# Altium schematic sheet mcu.SchDoc: mcu
size 420 x 297 mm; Date: 2021-12-08; Author: Joachim Löfwander; Revision: AAA-000; SheetNumber: 3; SheetTotal: 4; Website: github.com/jlofw
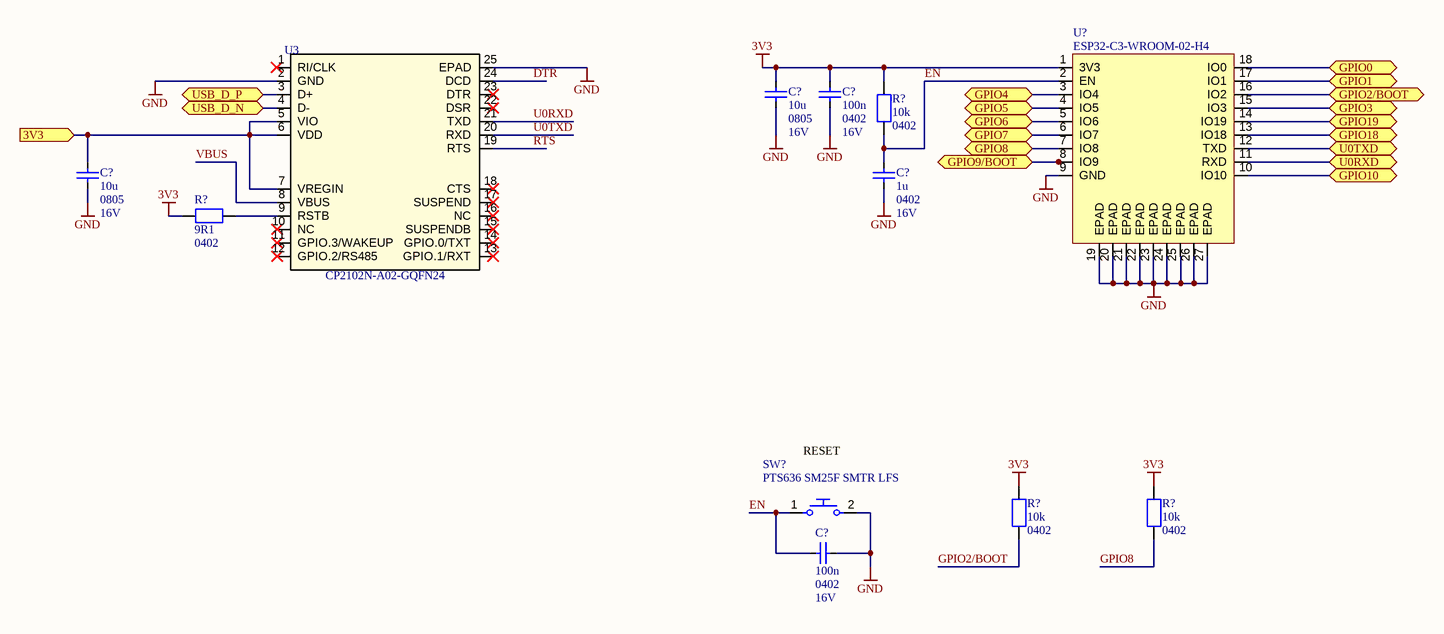
[diagram p0: mcu.SchDoc]

## Parts
(Parts that share a designator on the sheet are numbered #1, #2 ... from top to bottom, then left to right.)
C?#1  value 10u  Package: 0805  Voltage: 16V  [C_0805_2012Metric_IPCB]  (hidden comment: capacitor_ceramic)
C?#2  value 100n  Package: 0402  Voltage: 16V  [C_0402_1005Metric_IPCB]  (hidden comment: capacitor_ceramic)
C?#3  value 10u  Package: 0805  Voltage: 16V  [C_0805_2012Metric_IPCB]  (hidden comment: capacitor_ceramic)
C?#4  value 1u  Package: 0402  Voltage: 16V  [C_0402_1005Metric_IPCB]  (hidden comment: capacitor_ceramic)
C?#5  value 100n  Package: 0402  Voltage: 16V  [C_0402_1005Metric_IPCB]  (hidden comment: capacitor_ceramic)
R?#1  value 10k  Package: 0402  [R_0402_1005Metric_IPCB]  (hidden comment: resistor)
R?#2  value 9R1  Package: 0402  [R_0402_1005Metric_IPCB]  (hidden comment: resistor)
R?#3  value 10k  Package: 0402  [R_0402_1005Metric_IPCB]  (hidden comment: resistor)
R?#4  value 10k  Package: 0402  [R_0402_1005Metric_IPCB]  (hidden comment: resistor)
SW?  Manufacturer P/N: PTS636 SM25F SMTR LFS  [Pushbutton_PTS636_SM25F_SMTR_LFS]  (hidden comment: SW_single_no_bridging_pads)
U3  Manufacturer P/N: CP2102N-A02-GQFN24  [CP2102N_QFN24]  (hidden comment: CP2102N_QFN24)
U?  ESP32-C3-WROOM-02-H4  [ESP32-C3-WROOM-02-H4]

## Ports
3V3 (in), GPIO0 (bidir), GPIO1 (bidir), GPIO2/BOOT (bidir), GPIO3 (bidir), GPIO4 (bidir), GPIO5 (bidir), GPIO6 (bidir), GPIO7 (bidir), GPIO8 (bidir), GPIO9/BOOT (bidir), GPIO10 (bidir), GPIO18 (bidir), GPIO19 (bidir), U0RXD (bidir), U0TXD (bidir), USB_D_N (bidir), USB_D_P (bidir)

## Nets
3V3: C?#1.2 C?#2.2 R?#1.2 R?#2.1 R?#3.2 R?#4.2 U?.1(3V3)
GND: C?#1.1 C?#2.1 C?#3.1 C?#4.1 C?#5.2 SW?.2 U3.2(GND) U3.25(EPAD) U?.9(GND) U?.19(EPAD) U?.20(EPAD) U?.21(EPAD) U?.22(EPAD) U?.23(EPAD) U?.24(EPAD) U?.25(EPAD) U?.26(EPAD) U?.27(EPAD)
3V3: C?#3.2 U3.5(VIO) U3.6(VDD) U3.7(VREGIN) ; port 3V3  [a separate net that carries the same name]
DTR: U3.24(DCD)
EN: C?#4.2 C?#5.1 R?#1.1 SW?.1 U?.2(EN)
GPIO0: U?.18(IO0) ; port GPIO0
GPIO1: U?.17(IO1) ; port GPIO1
GPIO2/BOOT: U?.16(IO2) ; port GPIO2/BOOT
GPIO2/BOOT: R?#3.1  [a separate net that carries the same name]
GPIO3: U?.15(IO3) ; port GPIO3
GPIO4: U?.3(IO4) ; port GPIO4
GPIO5: U?.4(IO5) ; port GPIO5
GPIO6: U?.5(IO6) ; port GPIO6
GPIO7: U?.6(IO7) ; port GPIO7
GPIO8: U?.7(IO8) ; port GPIO8
GPIO8: R?#4.1  [a separate net that carries the same name]
GPIO9/BOOT: U?.8(IO9) ; port GPIO9/BOOT
GPIO10: U?.10(IO10) ; port GPIO10
GPIO18: U?.13(IO18) ; port GPIO18
GPIO19: U?.14(IO19) ; port GPIO19
RTS: U3.19(RTS)
U0RXD: U3.21(TXD)
U0RXD: U?.11(RXD) ; port U0RXD  [a separate net that carries the same name]
U0TXD: U3.20(RXD)
U0TXD: U?.12(TXD) ; port U0TXD  [a separate net that carries the same name]
USB_D_N: U3.4(D-) ; port USB_D_N
USB_D_P: U3.3(D+) ; port USB_D_P
VBUS: U3.8(VBUS)
NetR?#2_2: R?#2.2 U3.9(RSTB)

Not connected (* = marked no-connect by the designer): U3 1(RI/CLK)* 10(NC)* 11(GPIO.3/WAKEUP)* 12(GPIO.2/RS485)* 13(GPIO.1/RXT)* 14(GPIO.0/TXT)* 15(SUSPENDB)* 16(NC)* 17(SUSPEND)* 18(CTS)* 22(DSR)* 23(DTR)*

## Notes on the sheet
- RESET
- PROJECT
- TITLE
- FILE NAME
- DATE MODIFIED
- SHEET
- REV
- OF
- AUTHOR
- WEBSITE

## Library data of the parts
C?#1 C?#3 = 20170: 16V 0805; Internal Number: 20170
C?#2 C?#5 = 20025: 16V 0402; Internal Number: 20025
C?#4 = 20031: 16V 0402; Internal Number: 20031
R?#1 R?#3 R?#4 = 10098: 0402 1%; Internal Number: 10098
R?#2 = 10025: 0402 1%; Internal Number: 10025
SW? = 100001: Manufacturer: C&K; Internal Number: 100001
U3 = 90002: USB to UART; Manufacturer: Silicon Labs; Internal Number: 90002; Package: QFN24
U? = 130001: ESP32 C3 SoC; Manufacturer: Espressif Systems; Internal Number: 130001; Manufacturer P/N: ESP32-C3-WROOM-02-H4; Package: SoC